# EAGLE design ADP5090 (EAGLE 7.1.0)
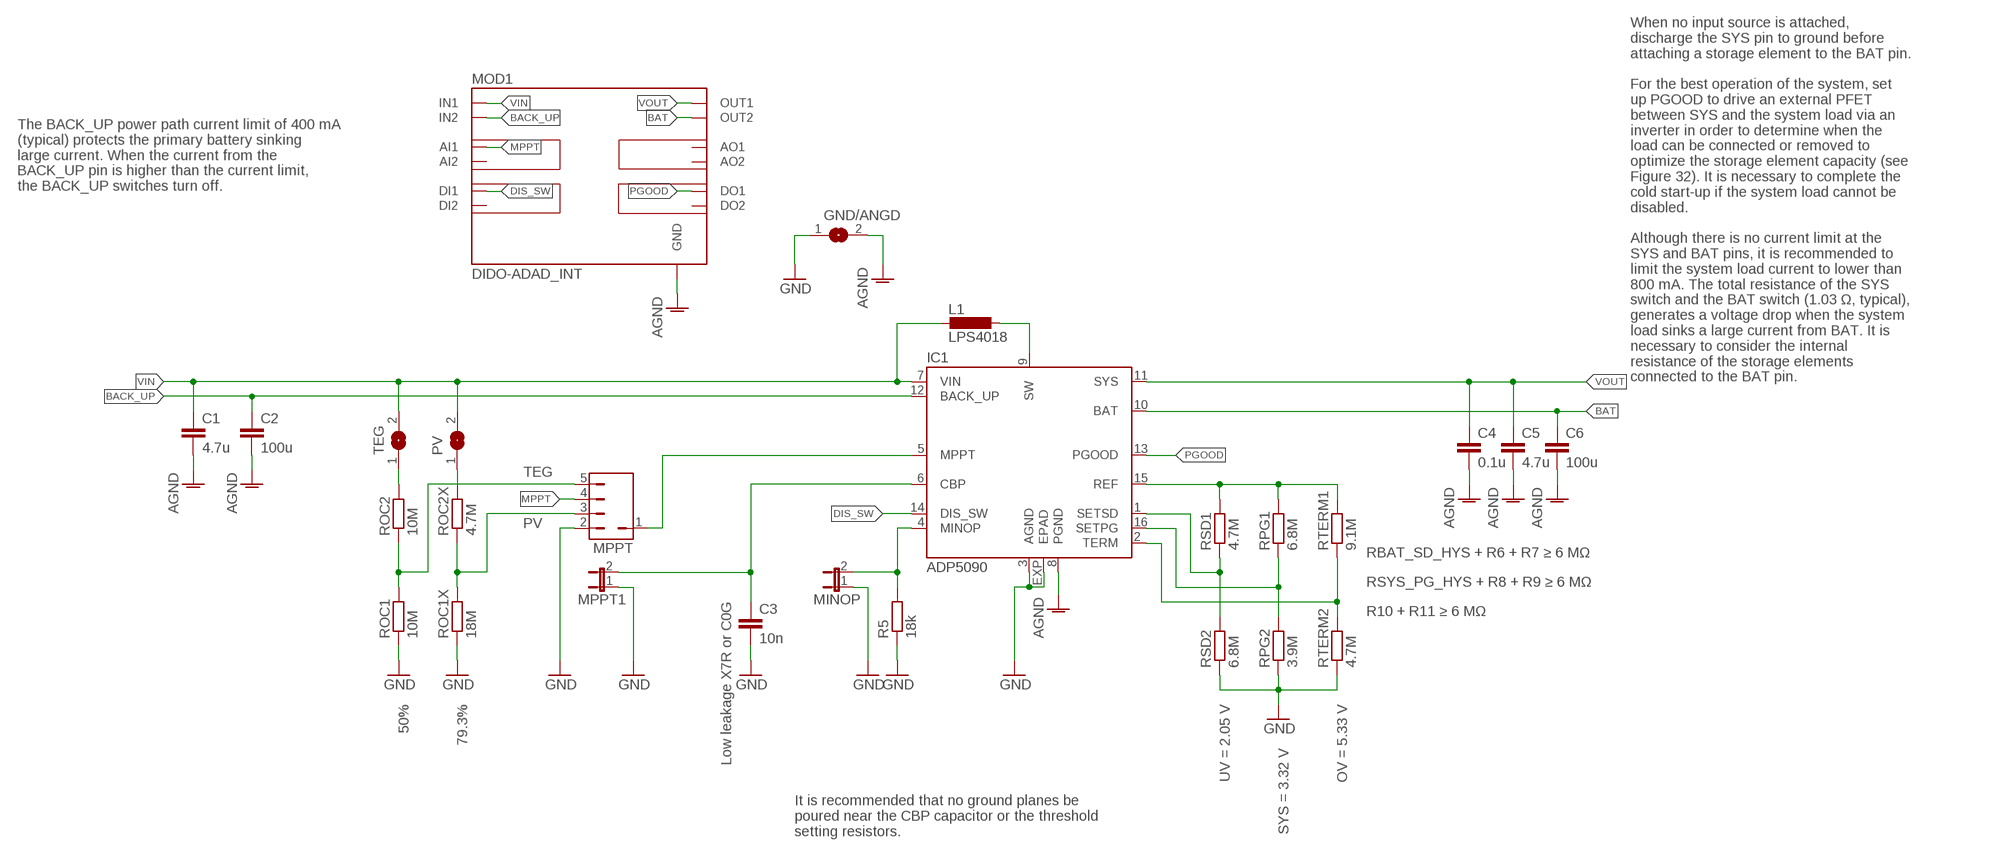
[diagram p0: schematic, sheet 1]

## Parts
C1  4.7u  C-EUC0805  [C0805]
C2  100u  C-EUC0805  [C0805]
C3  10n  C-EUC0805  [C0805]
C4  0.1u  C-EUC0805  [C0805]
C5  4.7u  C-EUC0805  [C0805]
C6  100u  C-EUC0805  [C0805]
GND/ANGD  SJ  [SJ]
IC1  ADP5090  [LFCSP16_WQ_CP-16-33]
L1  LPS4018  [LPS4018]
MINOP  JP1E  [JP1]
MOD1  DIDO-ADAD_INT  [DIDO-ADAD]
MPPT  JP3Q  [JP1-4]
MPPT1  JP1E  [JP1]
PV  SJ  [SJ]
R5  18k  R-EU_R0805  [R0805]
ROC1  10M  R-EU_R0805  [R0805]
ROC1X  18M  R-EU_R0805  [R0805]
ROC2  10M  R-EU_R0805  [R0805]
ROC2X  4.7M  R-EU_R0805  [R0805]
RPG1  6.8M  R-EU_R0805  [R0805]
RPG2  3.9M  R-EU_R0805  [R0805]
RSD1  4.7M  R-EU_R0805  [R0805]
RSD2  6.8M  R-EU_R0805  [R0805]
RTERM1  9.1M  R-EU_R0805  [R0805]
RTERM2  4.7M  R-EU_R0805  [R0805]
TEG  SJ  [SJ]

## Nets
AGND: C1.2 C2.2 C4.2 C5.2 C6.2 GND/ANGD.2 IC1.8(PGND) MOD1.GND1(GND) MOD1.GND2(GND) MOD1.GND3(GND) MOD1.GND4(GND)
BACK_UP: C2.1 IC1.12(BACK_UP) MOD1.IN2_1(IN2) MOD1.IN2_2(IN2) MOD1.IN2_3(IN2) MOD1.IN2_4(IN2)
BAT: C6.1 IC1.10(BAT) MOD1.OUT2_1(OUT2) MOD1.OUT2_2(OUT2) MOD1.OUT2_3(OUT2) MOD1.OUT2_4(OUT2)
DIS_SW: IC1.14(DIS_SW) MOD1.DI1
GND: C3.2 GND/ANGD.1 IC1.3(AGND) IC1.EXP(EPAD) MINOP.1 MPPT1.1 MPPT.2 R5.1 ROC1.1 ROC1X.1 RPG2.1 RSD2.1 RTERM2.1
MPPT: MOD1.AI1 MPPT.4
N$1: IC1.15(REF) RPG1.2 RSD1.2 RTERM1.2
N$2: IC1.1(SETSD) RSD1.1 RSD2.2
N$3: IC1.16(SETPG) RPG1.1 RPG2.2
N$4: IC1.2(TERM) RTERM1.1 RTERM2.2
N$5: C3.1 IC1.6(CBP) MPPT1.2
N$6: MPPT.3 ROC1X.2 ROC2X.1
N$7: IC1.5(MPPT) MPPT.1
N$8: ROC2.2 TEG.1
N$9: MPPT.5 ROC1.2 ROC2.1
N$10: PV.1 ROC2X.2
N$14: IC1.9(SW) L1.2
N$16: IC1.4(MINOP) MINOP.2 R5.2
PGOOD: IC1.13(PGOOD) MOD1.DO1
VIN: C1.1 IC1.7(VIN) L1.1 MOD1.IN1_1(IN1) MOD1.IN1_2(IN1) MOD1.IN1_3(IN1) MOD1.IN1_4(IN1) PV.2 TEG.2
VOUT: C4.1 C5.1 IC1.11(SYS) MOD1.OUT1_1(OUT1) MOD1.OUT1_2(OUT1) MOD1.OUT1_3(OUT1) MOD1.OUT1_4(OUT1)
Unconnected: MOD1.AI2 MOD1.AO1 MOD1.AO2 MOD1.DI2 MOD1.DO2

## Notes on the sheet
- The BACK_UP power path current limit of 400 mA
  (typical) protects the primary battery sinking
  large current. When the current from the
  BACK_UP pin is higher than the current limit,
  the BACK_UP switches turn off.
- When no input source is attached,
  discharge the SYS pin to ground before
  attaching a storage element to the BAT pin.
  
  For the best operation of the system, set
  up PGOOD to drive an external PFET
  between SYS and the system load via an
  inverter in order to determine when the
  load can be connected or removed to
  optimize the storage element capacity (see
  Figure 32). It is necessary to complete the
  cold start-up if the system load cannot be
  disabled.
  
  Although there is no current limit at the
  SYS and BAT pins, it is recommended to
  limit the system load current to lower than
  800 mA. The total resistance of the SYS
  switch and the BAT switch (1.03 Ω, typical),
  generates a voltage drop when the system
  load sinks a large current from BAT. It is
  necessary to consider the internal
  resistance of the storage elements
  connected to the BAT pin.
- TEG
- PV
- RBAT_SD_HYS + R6 + R7 ≥ 6 MΩ
- RSYS_PG_HYS + R8 + R9 ≥ 6 MΩ
- Low leakage X7R or C0G
- R10 + R11 ≥ 6 MΩ
- 50% | 79.3% | UV = 2.05 V | OV = 5.33 V
- SYS = 3.32 V
- It is recommended that no ground planes be
  poured near the CBP capacitor or the threshold
  setting resistors.

## Library data of the parts
C1-C6 = rcl:C-EU: CAPACITOR, European symbol
GND/ANGD PV TEG = jumper:SJ: SMD solder JUMPER
IC1 = ADP5090:ADP5090: ANALOG DEVICES
L1 = LPS4018:LPS4018: COILCRAFT
MINOP MPPT1 = jumper:JP1E: JUMPER
MOD1 = AllModules:DIDO-ADAD_INT
MPPT = Jumper_mod:JP3Q: JUMPER
R5 ROC1 ROC1X ROC2 ROC2X RPG1 RPG2 RSD1 RSD2 RTERM1 RTERM2 = rcl:R-EU_: RESISTOR, European symbol

## Board
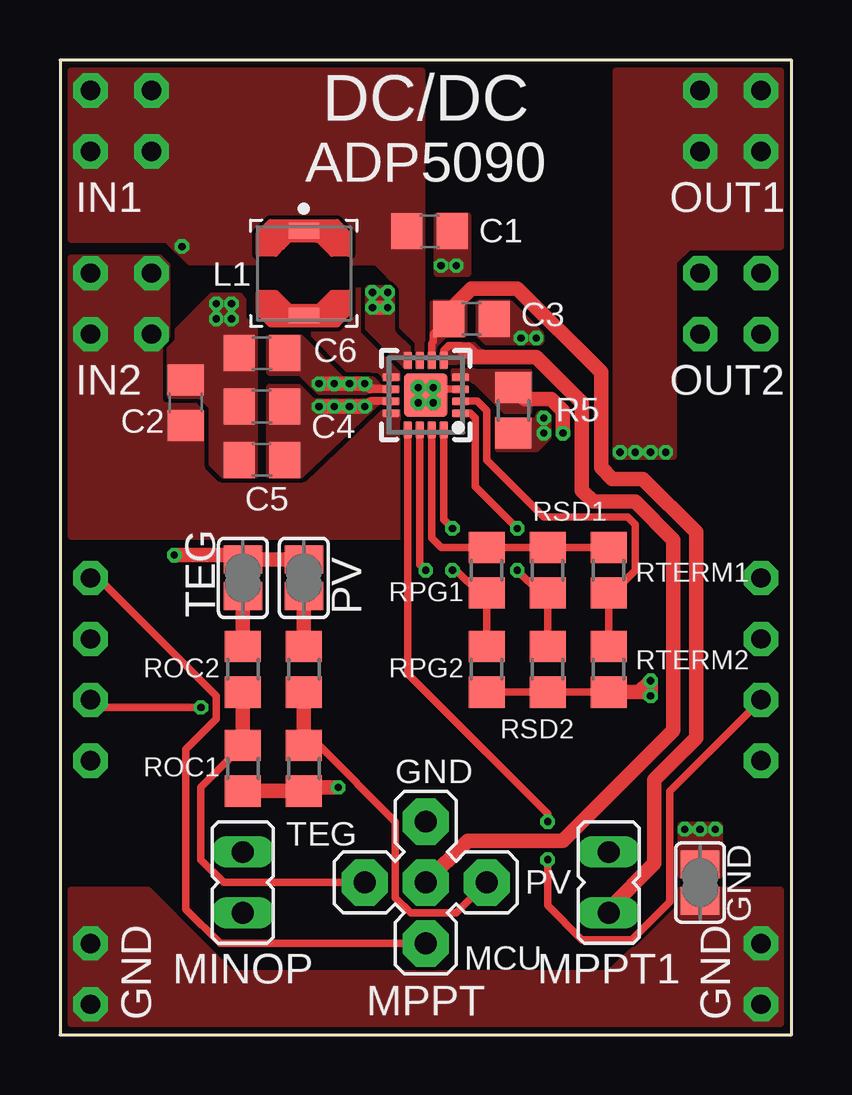
[diagram p1: board, top side]
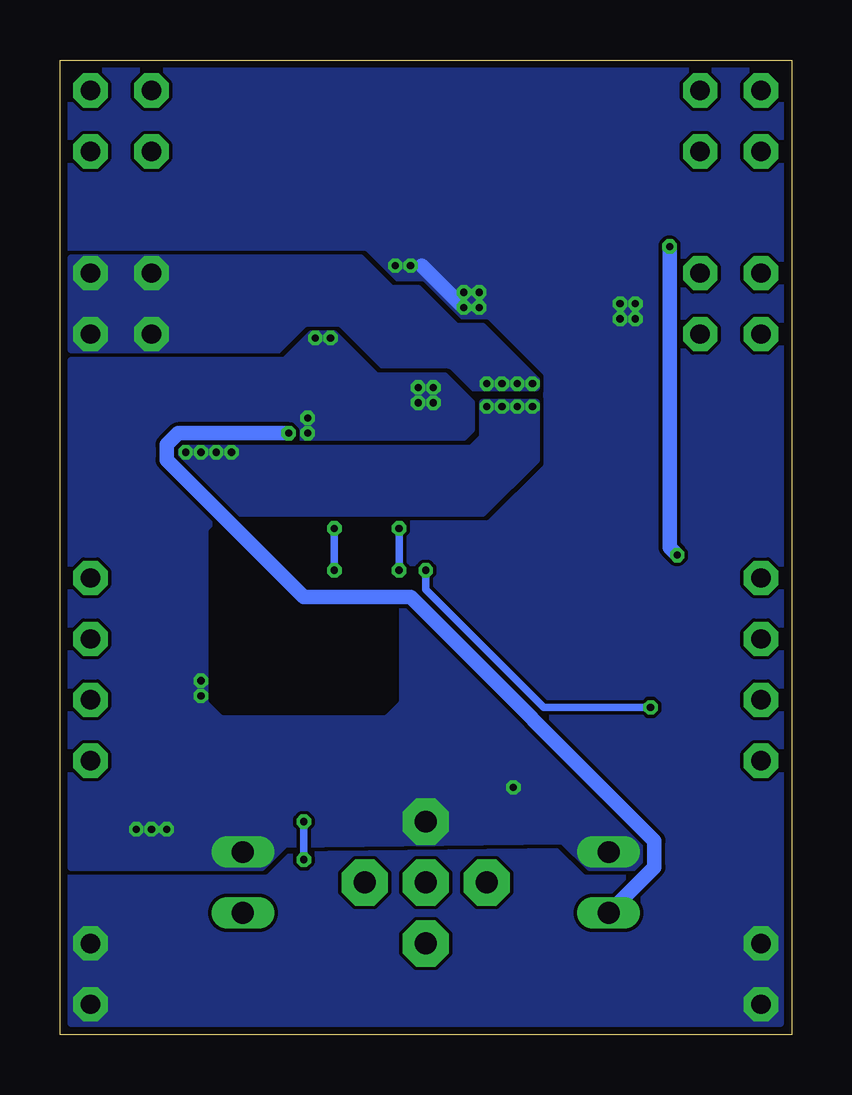
[diagram p2: board, bottom side, seen from below]

Size 30.48 x 40.64 mm. Coordinates in mm from the lower left corner, seen from the top.
Outline: 0,0 30.48,0 30.48,40.64 0,40.64 0,0
Copper layers (1*16): Top 0.035mm / dielectric 1.5mm / Bottom 0.035mm
Design rules "PCB-POOL Standard": minimum track width 0.15mm, minimum drill 0.3mm, track to track 0.15mm, track to pad 0.15mm, pad to pad 0.15mm, via to via 0.15mm, smd to smd 0.15mm, copper to edge 0.3mm, drill to drill 0.2mm, minimum pad ring 0.2mm, minimum via ring 0.15mm, stop-mask expansion 0.075mm, vias tented up to drill 0mil, thermal gap 0.2mm

### Footprints (pad centres in the part's own frame; a part is rotated, then mirrored left to right if it is on the bottom)
C0805 = smd 1.3 x 1.5: 1 -0.95,0; 2 0.95,0
SJ = smd 1.168 x 1.6: 1 -0.762,0; 2 0.762,0
LFCSP16_WQ_CP-16-33 = smd 0.7 x 0.34: 1 -1.45,0.75; 2 -1.45,0.25; 3 -1.45,-0.25; 4 -1.45,-0.75; 9 1.45,-0.75; 10 1.45,-0.25; 11 1.45,0.25; 12 1.45,0.75 | smd 0.34 x 0.7: 5 -0.75,-1.45; 6 -0.25,-1.45; 7 0.25,-1.45; 8 0.75,-1.45; 13 0.75,1.45; 14 0.25,1.45; 15 -0.25,1.45; 16 -0.75,1.45 | smd 1.8 x 1.8: EXP 0,0
LPS4018 = smd 0.635 x 1.27: 1 -1.765,0; 2 1.765,0
JP1 = drill 0.914 long: 1 0,-1.27; 2 0,1.27
DIDO-ADAD = drill 0.8 pad 1.422 octagon: AI1 0,-20.32; AI2 0,-22.86; AO1 27.94,-20.32; AO2 27.94,-22.86; DI1 0,-25.4; DI2 0,-27.94; DO1 27.94,-25.4; DO2 27.94,-27.94; GND1 0,-38.1; GND2 0,-35.56; GND3 27.94,-35.56; GND4 27.94,-38.1; IN1_1 0,0; IN1_2 0,-2.54; IN1_3 2.54,0; IN1_4 2.54,-2.54; IN2_1 0,-7.62; IN2_2 0,-10.16; IN2_3 2.54,-7.62; IN2_4 2.54,-10.16; OUT1_1 25.4,0; OUT1_2 25.4,-2.54; OUT1_3 27.94,0; OUT1_4 27.94,-2.54; OUT2_1 25.4,-7.62; OUT2_2 25.4,-10.16; OUT2_3 27.94,-7.62; OUT2_4 27.94,-10.16
JP1-4 = drill 0.914 pad 1.93 octagon: 1 0,0; 2 0,2.54; 3 2.54,0; 4 0,-2.54; 5 -2.54,0
R0805 = smd 1.3 x 1.5: 1 -0.95,0; 2 0.95,0

### Placement (x,y rotation side)
C1  15.4,33.5 0 top
C2  5.24,26.35 90 top
C3  17.14,29.84 0 top
C4  8.41,26.19 180 top
C5  8.41,23.97 180 top
C6  8.41,28.42 180 top
GND/ANGD  26.67,6.35 270 top
IC1  15.24,26.67 180 top
L1  10.16,31.75 270 top
MINOP  7.62,6.35 180 top
MOD1  1.27,39.37 0 top
MPPT  15.24,6.35 0 top
MPPT1  22.86,6.35 180 top
PV  10.16,19.05 90 top
R5  18.89,26.04 90 top
ROC1  7.62,11.11 90 top
ROC1X  10.16,11.11 90 top
ROC2  7.62,15.24 90 top
ROC2X  10.16,15.24 90 top
RPG1  17.78,19.37 90 top
RPG2  17.78,15.24 90 top
RSD1  20.32,19.37 90 top
RSD2  20.32,15.24 90 top
RTERM1  22.86,19.37 90 top
RTERM2  22.86,15.24 90 top
TEG  7.62,19.05 90 top

### Tracks (layer width: path | path; a pad name or v marks a point on that pad's centre or on a via)
AGND  (via drill 0.3)
  Top 0.61: v13.65,30.32 v13.02,30.32
  Bottom 0.61: v13.65,30.32 15.4,32.07
  other vias: 16.51,32.07 15.88,32.07 13.02,30.96 7.14,30.48 7.14,29.84 6.51,29.84 13.65,30.96 6.51,30.48
  pour Top (no thermals): 15.72,31.75 15.72,34.13 16.99,34.13 16.99,31.75
  pour Top (rank 3, no thermals): 14.61,27.78 14.45,27.78 12.86,29.37 12.86,31.12 13.81,31.12 13.81,29.37 14.61,28.58
  pour Bottom (rank 6, no thermals): 0.48,40.16 0.48,0.48 30,0.48 30,40.16
  pour Top (no thermals): 0.48,0.48 30,0.48 30,6.03 25.88,6.03 25.88,5.4 22.86,2.54 7.14,2.54 3.65,6.03 0.48,6.03
  pour Top (no thermals): 8.1,23.34 6.83,23.34 6.35,23.81 6.35,26.19 5.87,26.67 4.6,26.67 4.6,28.58 4.92,28.89 4.92,29.37 6.35,30.8 7.46,30.8 7.62,30.64 7.62,29.84 8.1,29.37
BACK_UP
  pour Top (rank 3, no thermals): 0.48,32.38 0.48,20.8 14.13,20.8 14.13,26.04 13.34,26.04 10.16,22.86 6.67,22.86 5.87,23.65 5.87,26.19 4.45,26.19 4.13,26.51 4.13,28.26 4.45,28.58 4.45,32.07 4.13,32.38
BAT  (via drill 0.3)
  Top 0.305: 13.09,26.92 v12.7,27.15
  Top 0.33: IC1.10 12.93,26.92 v12.7,27.15
  Top 0.61: v12.7,27.15 v12.06,27.15 v11.43,27.15 v10.79,27.15
  pour Bottom (rank 4, no thermals): 13.34,26.99 10.64,26.99 10.64,27.3 12.86,29.53 13.97,29.53 15.56,31.12 16.67,31.12 17.94,32.38 30,32.38 30,28.58 20.95,28.58 20.16,29.37 18.89,29.37 17.46,27.94 14.29,27.94
  pour Top (no thermals): 8.73,29.05 10,29.05 11.75,27.3 13.02,27.3 13.34,26.99 13.34,26.83 10.79,26.83 10,27.62 8.73,27.62
DIS_SW  (via drill 0.3)
  Top 0.305: IC1.14 14.99,19.62 v15.24,19.37 | v5.87,13.65 1.59,13.65 MOD1.DI1
  Bottom 0.305: v15.24,19.37 15.24,18.57 10.32,13.65 v5.87,13.65
GND  (via drill 0.3)
  Top 0.305: IC1.3 15.49,26.92 IC1.EXP | v15.56,26.99 IC1.EXP | v14.92,26.35 v14.92,26.99 IC1.EXP | IC1.EXP v15.56,26.35 | RPG2.1 RSD2.1 RTERM2.1 | 10.64,10 ROC1X.1 10.32,10.32
  Top 0.61: ROC1.1 ROC1X.1 | v11.59,10.32 10.32,10.32 | RTERM2.1 24.13,14.29 v24.61,14.76 v24.61,14.13 24.45,14.29 23.81,14.29
  other vias: 19.21,29.05 19.84,29.05 20.16,25.72 20.16,25.08 26.04,8.57 26.67,8.57 27.3,8.57
  pour Bottom (rank 3, no thermals): 14.45,27.46 13.34,26.35 13.34,25.24 13.65,24.92 26.04,24.92 26.35,24.61 26.35,24.13 20.64,18.41 19.05,18.41 15.88,18.26 6.35,8.73 6.35,6.98 8.41,6.98 9.53,8.1 21.11,7.94 22.07,6.98 30,6.98 30,28.1 21.11,28.1 20,29.21 19.05,29.21 17.3,27.46
  pour Top (no thermals): 17.46,30.48 17.46,29.21 17.78,28.89 20,28.89 20,29.21 18.73,30.48
  pour Top (rank 4, no thermals): 18.26,25.72 18.26,24.45 19.84,24.45 20.32,24.92 20.32,25.88 20,25.88 19.84,25.72
  pour Top (no thermals): 27.46,6.67 27.46,8.73 25.88,8.73 25.88,6.67
MPPT
  Top 0.305: MPPT.4 6.67,3.81 5.24,5.24 5.24,11.91 6.51,13.18 6.51,14.13 1.59,19.05 MOD1.AI1
N$1
  Top 0.305: RTERM1.2 RSD1.2 RPG1.2 15.88,20.32 15.49,20.71 IC1.15
N$2  (via drill 0.3)
  Top 0.305: v19.05,19.37 20,18.42 RSD1.1 RSD2.2 | IC1.1 17.1,25.92 17.3,25.72 17.3,22.86 v19.05,21.11
  Bottom 0.305: v19.05,21.11 v19.05,19.37
N$3  (via drill 0.3)
  Top 0.305: v16.35,19.37 16.51,19.37 17.46,18.42 RPG1.1 RPG2.2 | IC1.16 15.99,21.48 v16.35,21.11
  Bottom 0.305: v16.35,21.11 v16.35,19.37
N$4
  Top 0.305: RTERM2.2 RTERM1.1 23.02,18.42 23.97,19.37 23.97,21.27 23.65,21.59 20.16,21.59 17.78,23.97 17.78,26.04 17.39,26.42 IC1.2
N$5
  Top 0.305: IC1.6 15.49,28.83 15.56,28.89 15.56,29.21 C3.1
  Top 0.61: C3.1 16.2,30.16 17.14,31.12 19.05,31.12 22.54,27.62 22.54,23.65 23.02,23.18 24.29,23.18 26.51,20.96 26.51,12.38 24.77,10.64 24.77,7.14 22.86,5.24 MPPT1.2
  pour Top (rank 2, no thermals): 15.4,27.78 15.4,28.73 15.56,28.89 15.56,30.48 16.83,30.48 16.83,29.21 16.03,29.21 15.56,28.73 15.56,27.78
N$6
  Top 0.305: MPPT.3 16.51,5.08 14.61,5.08 13.97,5.72 13.97,8.89 10.8,12.06 ROC1X.2
  Top 0.61: ROC2X.1 ROC1X.2
N$7
  Top 0.305: IC1.5 15.99,28.53 16.19,28.73 16.67,28.73
  Top 0.61: 16.83,28.58 16.99,28.58 17.3,28.26 19.84,28.26 21.75,26.35 21.75,22.7 22.23,22.23 23.97,22.23 25.56,20.64 25.56,12.7 20.95,8.1 16.99,8.1 MPPT.1
  pour Top (rank 5, no thermals): 16.19,27.78 15.88,27.78 15.88,28.42 16.19,28.73 17.3,28.73 17.62,28.42 17.62,28.1 16.51,28.1
N$8
  Top 0.61: TEG.1 ROC2.2
N$9
  Top 0.305: MPPT.5 6.83,6.35 5.87,7.3 5.87,10.32 ROC1.2
  Top 0.61: ROC2.1 ROC1.2
N$10
  Top 0.61: PV.1 ROC2X.2
N$11
  cutout Bottom (no thermals): 16.99,21.43 16.51,20.96 16.51,13.97 16.99,13.49 23.65,13.49 24.13,13.97 24.13,20.96 23.65,21.43
N$14
  pour Top (rank 2, no thermals): 14.13,27.3 13.49,27.3 13.02,27.78 10.48,27.78 8.26,30 8.26,31.12 12.38,31.12 12.38,29.21 14.13,27.46
N$16  (via drill 0.3)
  Top 0.61: R5.2 19.36,26.51 20.48,26.51 20.95,26.04 v20.95,25.08
  Bottom 0.61: v20.95,25.08 25.56,25.08 26.04,24.61 26.04,23.97 20.32,18.26 15.88,18.26 5.71,8.1 5.71,6.98 MINOP.2
  pour Top (rank 2, no thermals): 16.35,27.3 16.35,27.62 19.53,27.62 19.53,26.04 18.57,26.04 17.3,27.3
PGOOD  (via drill 0.3)
  Top 0.305: IC1.13 14.49,15.04 20.32,9.21 v20.32,8.89 | v20.32,7.3 20.32,5.4 21.75,3.97 23.81,3.97 25.4,5.56 25.4,10.16 MOD1.DO1
  Bottom 0.305: v20.32,8.89 v20.32,7.3
VIN  (via drill 0.3)
  Top 0.305: TEG.2 7.78,19.97
  Top 0.61: PV.2 TEG.2 7.43,20 v4.76,20
  Bottom 0.61: v4.76,20 5.08,20.32 v5.08,32.86
  pour Top (no thermals): 0.48,40.16 0.48,33.18 4.29,33.18 4.45,33.18 5.4,32.23 14.92,32.23 14.92,40.16
  pour Top (no thermals): 12.7,32.23 13.18,32.23 14.29,31.12 14.29,29.53 14.92,28.89 14.92,27.78 15.08,27.78 15.08,40.16 12.7,40.16
VOUT  (via drill 0.3)
  Top 0.33: IC1.11 12.93,26.42 v12.7,26.19
  Top 0.61: v12.7,26.19 v12.06,26.19 v11.43,26.19 v10.79,26.19
  other vias: 24.61,24.29 23.97,24.29 23.34,24.29 25.24,24.29
  pour Bottom (rank 2, no thermals): 10.64,26.35 10.64,23.97 12.86,21.75 23.34,21.75 26.04,24.45 13.34,24.45 12.86,24.92 12.86,26.35
  pour Top (rank 3, no thermals): 23.18,24.13 25.56,24.13 25.56,32.23 26.19,32.86 30,32.86 30,40.16 23.18,40.16
  pour Top (rank 2, no thermals): 10.64,26.51 10.16,26.99 8.73,26.99 8.73,23.34 10,23.34 13.34,26.51

### Text on the board
tPlace: GND | TEG | GND | PV | MCU
tNames: DC/DC | ADP5090
bStop: Beckedahl & Kokert / 11.05.2015